# Altium schematic sheet INPUT STAGE.SchDoc: BULLSEYE
size A3; CompanyName: TYMPHANY; DrawnBy: Yetta.He; Organization: PABU; Address1: 11F,block A, CEC building,; Address2: No.2070 Shennan Zhong road,; Address3: Huaqiang North, Futian District,; Address4: Shenzhen,  Guang Dong, P.R.C 518000; DocumentNumber: 2; Revision: 0.0.5; SheetNumber: 2; SheetTotal: 7; Size: A3; Status: DP1
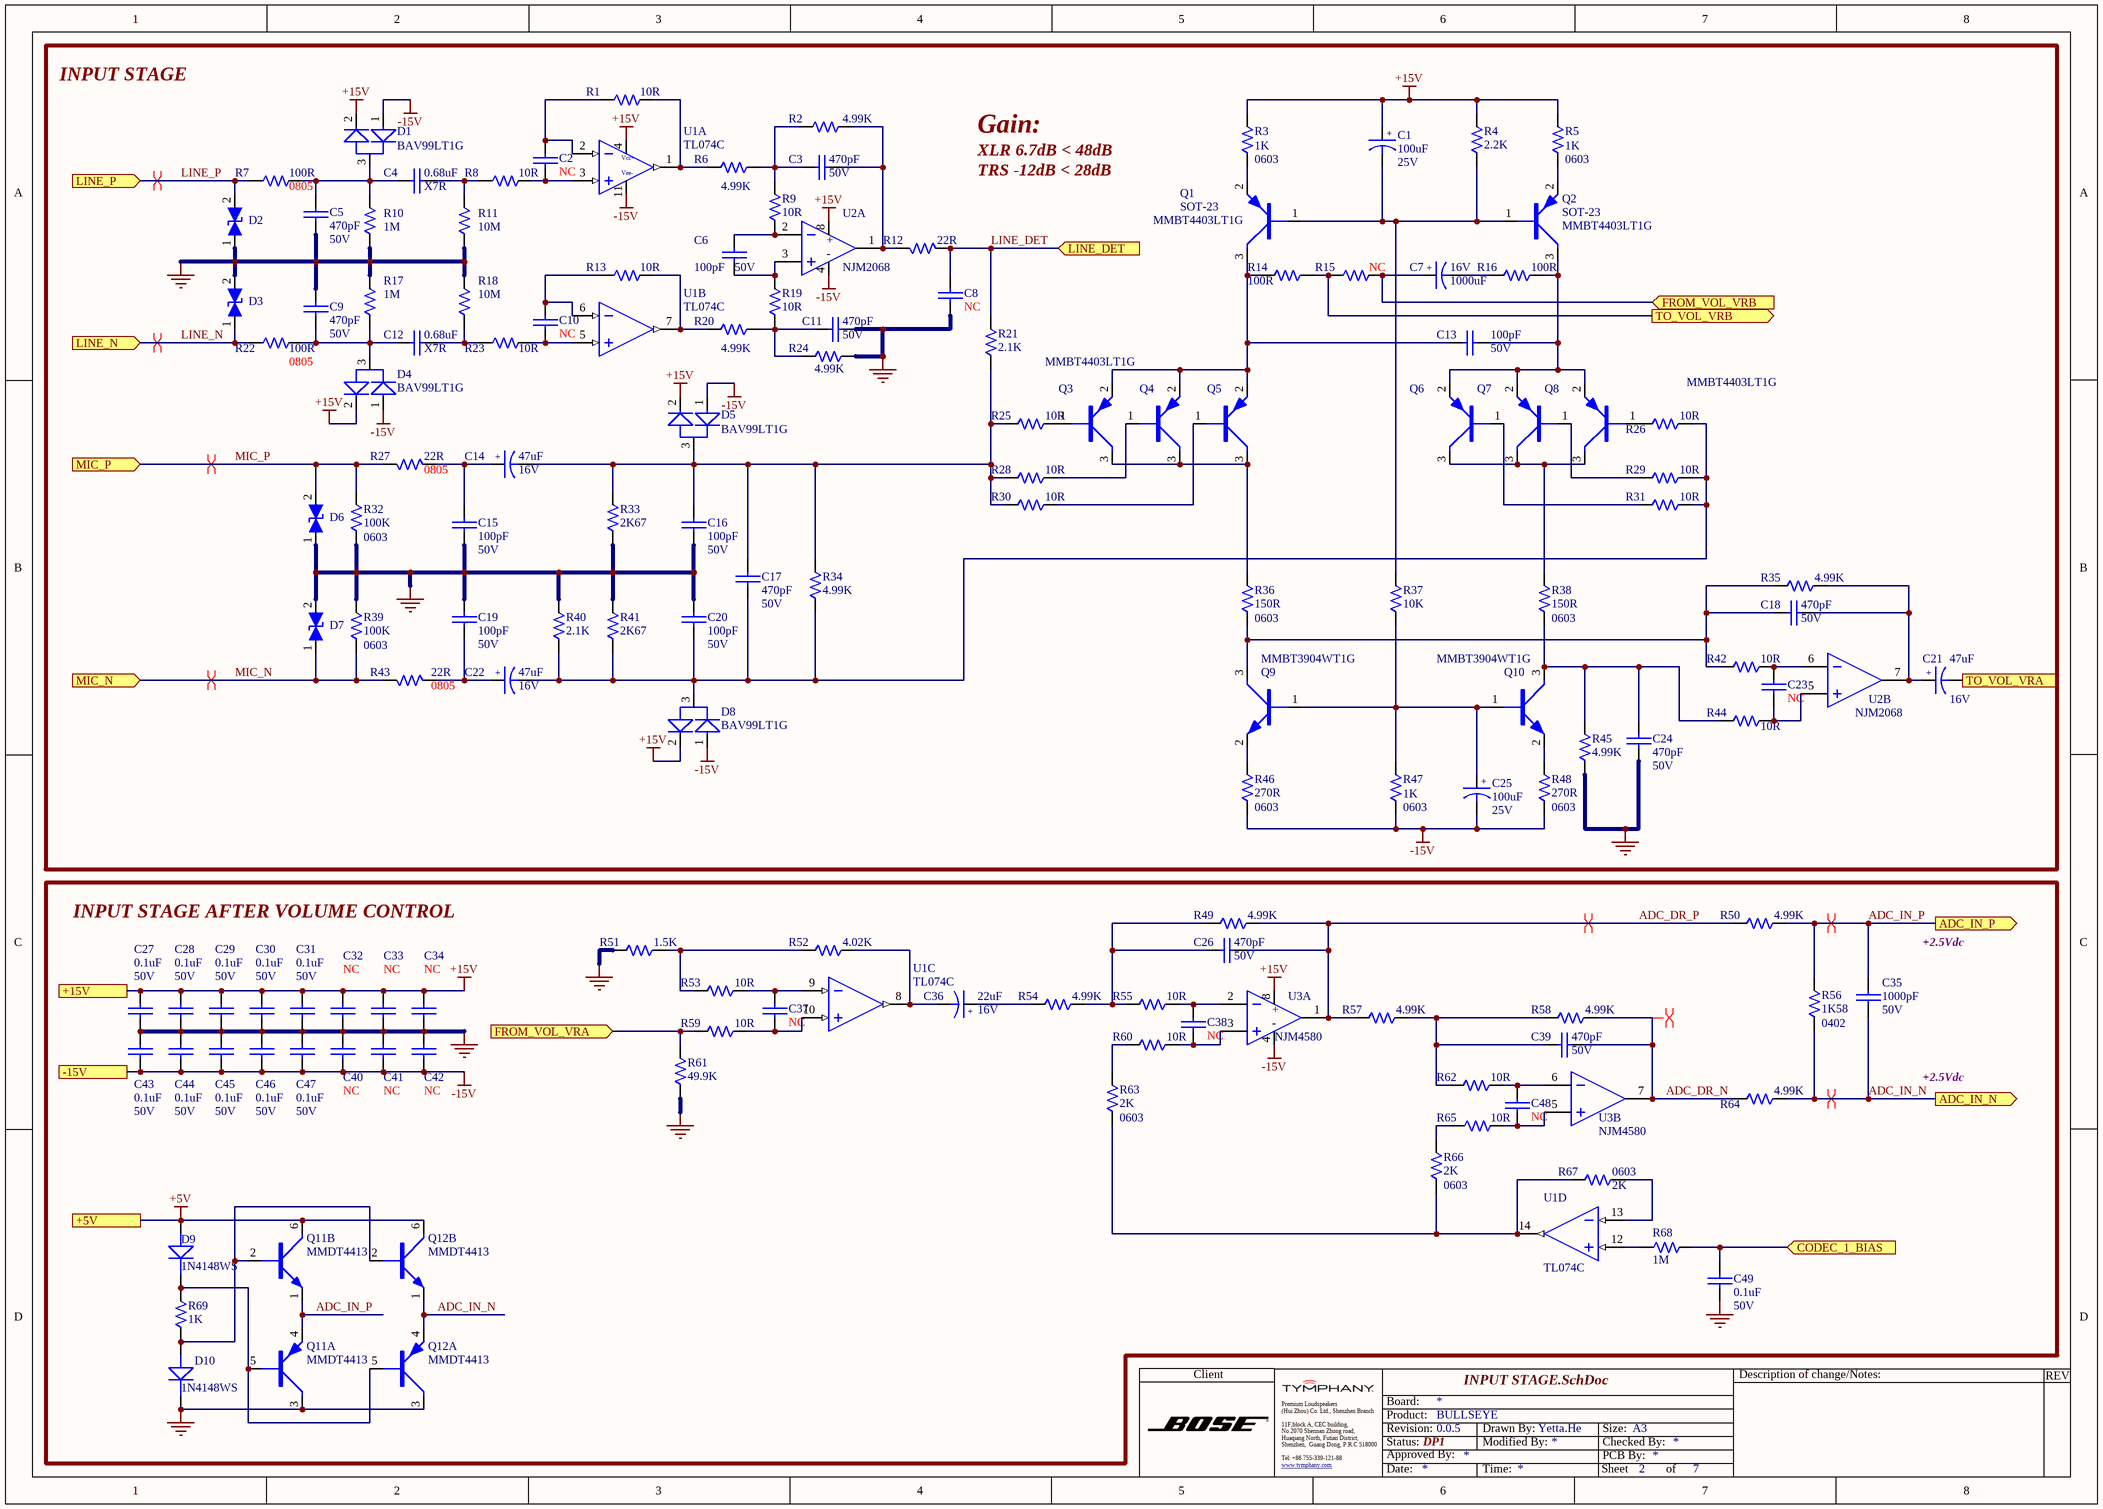
[diagram p0: INPUT STAGE.SchDoc]

## Parts
C1  value 100uF  Voltage: 25V  [CASE - D8]  (hidden comment: T551101445020)
C2  value NC  [CAPC0603-RW]  (hidden comment: CAP0603 NC)
C3  value 470pF  Voltage: 50V  [CAPC0603-RW]  (hidden comment: T541024715508)
C4  value 0.68uF  Other: X7R  [CAPC1206-RW]  (hidden comment: PZL456450-6840)
C5  value 470pF  Voltage: 50V  [CAPC0603-RW]  (hidden comment: T541024715508)
C6  value 100pF  Voltage: 50V  [CAPC0603-RW]  (hidden comment: T541021015508)
C7  value 1000uF  Voltage: 16V  [CAP_Radial_D8L16P3.5]  (hidden comment: T552102435010)
C8  value NC  [CAPC0603-RW]  (hidden comment: CAP0603 NC)
C9  value 470pF  Voltage: 50V  [CAPC0603-RW]  (hidden comment: T541024715508)
C10  value NC  [CAPC0603-RW]  (hidden comment: CAP0603 NC)
C11  value 470pF  Voltage: 50V  [CAPC0603-RW]  (hidden comment: T541024715508)
C12  value 0.68uF  Other: X7R  [CAPC1206-RW]  (hidden comment: PZL456450-6840)
C13  value 100pF  Voltage: 50V  [CAPC0603-RW]  (hidden comment: T541021015508)
C14  value 47uF  Voltage: 16V  [CASE - C5.7]  (hidden comment: T551470435020)
C15  value 100pF  Voltage: 50V  [CAPC0603-RW]  (hidden comment: T541021015508)
C16  value 100pF  Voltage: 50V  [CAPC0603-RW]  (hidden comment: T541021015508)
C17  value 470pF  Voltage: 50V  [CAPC0603-RW]  (hidden comment: T541024715508)
C18  value 470pF  Voltage: 50V  [CAPC0603-RW]  (hidden comment: T541024715508)
C19  value 100pF  Voltage: 50V  [CAPC0603-RW]  (hidden comment: T541021015508)
C20  value 100pF  Voltage: 50V  [CAPC0603-RW]  (hidden comment: T541021015508)
C21  value 47uF  Voltage: 16V  [CASE - C5.7]  (hidden comment: T551470435020)
C22  value 47uF  Voltage: 16V  [CASE - C5.7]  (hidden comment: T551470435020)
C23  value NC  [CAPC0603-RW]  (hidden comment: CAP0603 NC)
C24  value 470pF  Voltage: 50V  [CAPC0603-RW]  (hidden comment: T541024715508)
C25  value 100uF  Voltage: 25V  [CASE - D8]  (hidden comment: T551101445020)
C26  value 470pF  Voltage: 50V  [CAPC0603-RW]  (hidden comment: T541024715508)
C27  value 0.1uF  Voltage: 50V  [CAPC0402-RW]  (hidden comment: PWL456470-1040)
C28  value 0.1uF  Voltage: 50V  [CAPC0402-RW]  (hidden comment: PWL456470-1040)
C29  value 0.1uF  Voltage: 50V  [CAPC0402-RW]  (hidden comment: PWL456470-1040)
C30  value 0.1uF  Voltage: 50V  [CAPC0402-RW]  (hidden comment: PWL456470-1040)
C31  value 0.1uF  Voltage: 50V  [CAPC0402-RW]  (hidden comment: PWL456470-1040)
C32  value NC  [CAPC0603-RW]  (hidden comment: CAP0603 NC)
C33  value NC  [CAPC0603-RW]  (hidden comment: CAP0603 NC)
C34  value NC  [CAPC0603-RW]  (hidden comment: CAP0603 NC)
C35  value 1000pF  Voltage: 50V  [CAPC0603-RW]  (hidden comment: T541021025508)
C36  value 22uF  Voltage: 16V  [CASE - B]  (hidden comment: T551220435010)
C37  value NC  [CAPC0603-RW]  (hidden comment: CAP0603 NC)
C38  value NC  [CAPC0603-RW]  (hidden comment: CAP0603 NC)
C39  value 470pF  Voltage: 50V  [CAPC0603-RW]  (hidden comment: T541024715508)
C40  value NC  [CAPC0603-RW]  (hidden comment: CAP0603 NC)
C41  value NC  [CAPC0603-RW]  (hidden comment: CAP0603 NC)
C42  value NC  [CAPC0603-RW]  (hidden comment: CAP0603 NC)
C43  value 0.1uF  Voltage: 50V  [CAPC0402-RW]  (hidden comment: PWL456470-1040)
C44  value 0.1uF  Voltage: 50V  [CAPC0402-RW]  (hidden comment: PWL456470-1040)
C45  value 0.1uF  Voltage: 50V  [CAPC0402-RW]  (hidden comment: PWL456470-1040)
C46  value 0.1uF  Voltage: 50V  [CAPC0402-RW]  (hidden comment: PWL456470-1040)
C47  value 0.1uF  Voltage: 50V  [CAPC0402-RW]  (hidden comment: PWL456470-1040)
C48  value NC  [CAPC0603-RW]  (hidden comment: CAP0603 NC)
C49  value 0.1uF  Voltage: 50V  [CAPC0402-RW]  (hidden comment: PWL456470-1040)
D1  RCD100099-0010  [SOT23-132-RW]  (value not drawn)
D2  T710500020400  [VAR-0402]  (value not drawn)
D3  T710500020400  [VAR-0402]  (value not drawn)
D4  RCD100099-0010  [SOT23-132-RW]  (value not drawn)
D5  RCD100099-0010  [SOT23-132-RW]  (value not drawn)
D6  T710500020400  [VAR-0402]  (value not drawn)
D7  T710500020400  [VAR-0402]  (value not drawn)
D8  RCD100099-0010  [SOT23-132-RW]  (value not drawn)
D9  RCD114148-0020  [SOD-323]  (value not drawn)
D10  RCD114148-0020  [SOD-323]  (value not drawn)
Q1  Package: SOT-23  [SOT23-132-RW]  (hidden comment: T582003100440)
Q2  Package: SOT-23  [SOT23-132-RW]  (hidden comment: T582003100440)
Q3  T582003100440  [SOT23-132-RW]  (value not drawn)
Q4  T582003100440  [SOT23-132-RW]  (value not drawn)
Q5  T582003100440  [SOT23-132-RW]  (value not drawn)
Q6  T582003100440  [SOT23-132-RW]  (value not drawn)
Q7  T582003100440  [SOT23-132-RW]  (value not drawn)
Q8  T582003100440  [SOT23-132-RW]  (value not drawn)
Q9  T581004222440  [SOT323(SC-70)-R]  (value not drawn)
Q10  T581004222440  [SOT323(SC-70)-R]  (value not drawn)
Q11  RCC004413-0010  [SOT-363]  (value not drawn)  (parts A,B of 2)
Q12  RCC004413-0010  [SOT-363]  (value not drawn)  (parts A,B of 2)
R1  value 10R  [0603-RW]  (hidden comment: QCF011030-1009)
R2  value 4.99K  [0603-RW]  (hidden comment: QCF011030-4991)
R3  value 1K  PACKAGE: 0603  [0603-RW]  (hidden comment: QCF011030-1001)
R4  value 2.2K  [0603-RW]  (hidden comment: QCF011030-2201)
R5  value 1K  PACKAGE: 0603  [0603-RW]  (hidden comment: QCF011030-1001)
R6  value 4.99K  [0603-RW]  (hidden comment: QCF011030-4991)
R7  value 100R  PACKAGE: 0805  [0805-RW]  (hidden comment: QCF081022-1000)
R8  value 10R  [0603-RW]  (hidden comment: QCF011030-1009)
R9  value 10R  [0603-RW]  (hidden comment: QCF011030-1009)
R10  value 1M  [0603-RW]  (hidden comment: QCF011030-1004)
R11  value 10M  [0603-RW]  (hidden comment: QCF011030-1005)
R12  value 22R  [0805-RW]  (hidden comment: QCF081020-2209)
R13  value 10R  [0603-RW]  (hidden comment: QCF011030-1009)
R14  value 100R  [0402-RW]  (hidden comment: QCF161240-1000)
R15  value NC  [0603-RW]  (hidden comment: RES0603 NC)
R16  value 100R  [0402-RW]  (hidden comment: QCF161240-1000)
R17  value 1M  [0603-RW]  (hidden comment: QCF011030-1004)
R18  value 10M  [0603-RW]  (hidden comment: QCF011030-1005)
R19  value 10R  [0603-RW]  (hidden comment: QCF011030-1009)
R20  value 4.99K  [0603-RW]  (hidden comment: QCF011030-4991)
R21  value 2.1K  [0603-RW]  (hidden comment: QCF011030-2101)
R22  value 100R  PACKAGE: 0805  [0805-RW]  (hidden comment: QCF081022-1000)
R23  value 10R  [0603-RW]  (hidden comment: QCF011030-1009)
R24  value 4.99K  [0603-RW]  (hidden comment: QCF011030-4991)
R25  value 10R  [0603-RW]  (hidden comment: QCF011030-1009)
R26  value 10R  [0603-RW]  (hidden comment: QCF011030-1009)
R27  value 22R  PACKAGE: 0805  [0805-RW]  (hidden comment: QCF081020-2209)
R28  value 10R  [0603-RW]  (hidden comment: QCF011030-1009)
R29  value 10R  [0603-RW]  (hidden comment: QCF011030-1009)
R30  value 10R  [0603-RW]  (hidden comment: QCF011030-1009)
R31  value 10R  [0603-RW]  (hidden comment: QCF011030-1009)
R32  value 100K  PACKAGE: 0603  [0603-RW]  (hidden comment: QCF011030-1003)
R33  value 2K67  [0603-RW]  (hidden comment: T502267102399)
R34  value 4.99K  [0603-RW]  (hidden comment: QCF011030-4991)
R35  value 4.99K  [0603-RW]  (hidden comment: QCF011030-4991)
R36  value 150R  PACKAGE: 0603  [0603-RW]  (hidden comment: QCF011030-1500)
R37  value 10K  [0603-RW]  (hidden comment: QCF011030-1002)
R38  value 150R  PACKAGE: 0603  [0603-RW]  (hidden comment: QCF011030-1500)
R39  value 100K  PACKAGE: 0603  [0603-RW]  (hidden comment: QCF011030-1003)
R40  value 2.1K  [0603-RW]  (hidden comment: QCF011030-2101)
R41  value 2K67  [0603-RW]  (hidden comment: T502267102399)
R42  value 10R  [0603-RW]  (hidden comment: QCF011030-1009)
R43  value 22R  PACKAGE: 0805  [0805-RW]  (hidden comment: QCF081020-2209)
R44  value 10R  [0603-RW]  (hidden comment: QCF011030-1009)
R45  value 4.99K  [0603-RW]  (hidden comment: QCF011030-4991)
R46  value 270R  PACKAGE: 0603  [0603-RW]  (hidden comment: QCF011030-2700)
R47  value 1K  PACKAGE: 0603  [0603-RW]  (hidden comment: QCF011030-1001)
R48  value 270R  PACKAGE: 0603  [0603-RW]  (hidden comment: QCF011030-2700)
R49  value 4.99K  [0603-RW]  (hidden comment: QCF011030-4991)
R50  value 4.99K  [0603-RW]  (hidden comment: QCF011030-4991)
R51  value 1.5K  [0603-RW]  (hidden comment: QCF011030-1501)
R52  value 4.02K  [0603-RW]  (hidden comment: T502402102399)
R53  value 10R  [0603-RW]  (hidden comment: QCF011030-1009)
R54  value 4.99K  [0603-RW]  (hidden comment: QCF011030-4991)
R55  value 10R  [0603-RW]  (hidden comment: QCF011030-1009)
R56  value 1K58  Package: 0402  [0402-RW]  (hidden comment: T502158101399)
R57  value 4.99K  [0603-RW]  (hidden comment: QCF011030-4991)
R58  value 4.99K  [0603-RW]  (hidden comment: QCF011030-4991)
R59  value 10R  [0603-RW]  (hidden comment: QCF011030-1009)
R60  value 10R  [0603-RW]  (hidden comment: QCF011030-1009)
R61  value 49.9K  [0603-RW]  (hidden comment: QCF011030-4992)
R62  value 10R  [0603-RW]  (hidden comment: QCF011030-1009)
R63  value 2K  PACKAGE: 0603  [0603-RW]  (hidden comment: QCF011030-2001)
R64  value 4.99K  [0603-RW]  (hidden comment: QCF011030-4991)
R65  value 10R  [0603-RW]  (hidden comment: QCF011030-1009)
R66  value 2K  PACKAGE: 0603  [0603-RW]  (hidden comment: QCF011030-2001)
R67  value 2K  PACKAGE: 0603  [0603-RW]  (hidden comment: QCF011030-2001)
R68  value 1M  [0603-RW]  (hidden comment: QCF011030-1004)
R69  value 1K  [0603-RW]  (hidden comment: QCF011030-1001)
U1  RCI000740-1001  [SO14]  (value not drawn)  (parts A,B,C,D of 4)
U2  RCI002068-0001  [DMP8]  (value not drawn)  (parts A,B of 2)
U3  RCI004580-0001  [DMP8]  (value not drawn)  (parts A,B of 2)

## Blocks framed on the sheet
Gain:: C1-C25 D1-D8 Q1-Q10 R1-R48 U1 U2
INPUT STAGE AFTER VOLUME CONTROL: C26-C49 D9 D10 Q11 Q12 R49-R69 U1 U3

## Ports
+5V, +15V, -15V, ADC_IN_N (out), ADC_IN_P (out), CODEC_1_BIAS (in), FROM_VOL_VRA (in), FROM_VOL_VRB (in), LINE_DET (in), LINE_N (in), LINE_P (in), MIC_N (in), MIC_P (in), TO_VOL_VRA (out), TO_VOL_VRB (out)

## Nets
+5V: D9.1(A) Q11.6(D) Q12.6(D) ; port +5V
+15V: C1.1 C27.1 C28.1 C29.1 C30.1 C31.1 C32.1 C33.1 C34.1 D1.2(K) D4.2(K) D5.2(K) D8.2(K) R3.2 R4.2 R5.2 U1.4(+V) U2.8 U3.8 ; port +15V
-15V: C25.2 C40.1 C41.1 C42.1 C43.2 C44.2 C45.2 C46.2 C47.2 D1.1(A) D4.1(A) D5.1(A) D8.1(A) R46.1 R47.1 R48.1 U1.11(-V) U2.4 U3.4 ; port -15V
GND: C5.2 C8.1 C9.1 C11.2 C15.2 C16.2 C19.1 C20.2 C24.1 C27.2 C28.2 C29.2 C30.2 C31.2 C32.2 C33.2 C34.2 C40.2 C41.2 C42.2 C43.1 C44.1 C45.1 C46.1 C47.1 C49.2 D2.1 D3.2 D6.1 D7.2 D10.2(K) Q11.3(D) Q12.3(D) R10.1 R11.1 R17.2 R18.2 R24.1 R32.1 R33.1 R39.2 R40.2 R41.2 R45.1 R51.2 R61.1
ADC_DR_N: C39.2 R58.1 R64.2 U3.7(OUT)
ADC_DR_P: C26.2 R49.1 R50.2 R57.2 U3.1(OUT)
ADC_IN_N: C35.2 Q12.1(S) Q12.4(S) R56.1 R64.1 ; port ADC_IN_N
ADC_IN_P: C35.1 Q11.1(S) Q11.4(S) R50.1 R56.2 ; port ADC_IN_P
CODEC_1_BIAS: C49.1 R68.2 ; port CODEC_1_BIAS
FROM_VOL_VRA: R59.2 R61.2 ; port FROM_VOL_VRA
FROM_VOL_VRB: C7.1 R15.2 ; port FROM_VOL_VRB
LINE_DET: C8.2 R12.1 R21.2 ; port LINE_DET
LINE_N: D3.1 R22.1 ; port LINE_N
LINE_P: D2.2 R7.1 ; port LINE_P
MIC_N: D7.1 R39.1 R43.2 ; port MIC_N
MIC_P: D6.2 R27.2 R32.2 ; port MIC_P
TO_VOL_VRA: C21.2 ; port TO_VOL_VRA
TO_VOL_VRB: R14.1 R15.1 ; port TO_VOL_VRB
NetC1_2: C1.2 Q1.1(B) Q2.1(B) R4.1 R37.2
NetC2_1: C2.1 R1.1 U1.2(IN-)
NetC2_2: C2.2 R8.2 U1.3(IN+)
NetC3_1: C3.1 R2.2 R6.1 R9.2
NetC3_2: C3.2 R2.1 R12.2 U2.1(OUT)
NetC4_1: C4.1 C5.1 D1.3 R7.2 R10.2
NetC4_2: C4.2 R8.1 R11.2
NetC6_1: C6.1 R9.1 U2.2(IN-)
NetC6_2: C6.2 R19.2 U2.3(IN+)
NetC7_2: C7.2 R16.2
NetC9_2: C9.2 C12.1 D4.3 R17.1 R22.2
NetC10_1: C10.1 R13.1 U1.6(IN-)
NetC10_2: C10.2 R23.2 U1.5(IN+)
NetC11_1: C11.1 R19.1 R20.1 R24.2
NetC12_2: C12.2 R18.1 R23.1
NetC13_1: C13.1 Q2.3(C) Q6.2(E) Q7.2(E) Q8.2(E) R16.1
NetC13_2: C13.2 Q1.3(C) Q3.2(E) Q4.2(E) Q5.2(E) R14.2
NetC14_1: C14.1 C15.1 R27.1
NetC14_2: C14.2 C16.1 C17.1 D5.3 R21.1 R25.2 R28.2 R30.2 R33.2 R34.2
NetC17_2: C17.2 C20.1 C22.2 D8.3 R26.1 R29.1 R31.1 R34.1 R40.1 R41.1
NetC18_1: C18.1 C21.1 R35.1 U2.7(OUT)
NetC18_2: C18.2 Q9.3(C) R35.2 R36.1 R42.2
NetC19_2: C19.2 C22.1 R43.1
NetC23_1: C23.1 R42.1 U2.6(IN-)
NetC23_2: C23.2 R44.1 U2.5(IN+)
NetC24_2: C24.2 Q10.3(C) R38.1 R44.2 R45.2
NetC25_1: C25.1 Q9.1(B) Q10.1(B) R37.1 R47.2
NetC26_1: C26.1 R49.2 R54.1 R55.2
NetC36_1: C36.1 R54.2
NetC36_2: C36.2 R52.1 U1.8(OUT)
NetC37_1: C37.1 R59.1 U1.10(IN+)
NetC37_2: C37.2 R53.1 U1.9(IN-)
NetC38_1: C38.1 R60.1 U3.3(IN+)
NetC38_2: C38.2 R55.1 U3.2(IN-)
NetC39_1: C39.1 R57.1 R58.2 R62.2
NetC48_1: C48.1 R65.2 U3.5(IN+)
NetC48_2: C48.2 R62.1 U3.6(IN-)
NetD9_2: D9.2(K) Q11.5(G) Q12.5(G) R69.2
NetD10_1: D10.1(A) Q11.2(G) Q12.2(G) R69.1
NetQ1_2: Q1.2(E) R3.1
NetQ2_2: Q2.2(E) R5.1
NetQ3_1: Q3.1(B) R25.1
NetQ3_3: Q3.3(C) Q4.3(C) Q5.3(C) R36.2
NetQ4_1: Q4.1(B) R28.1
NetQ5_1: Q5.1(B) R30.1
NetQ6_1: Q6.1(B) R31.2
NetQ6_3: Q6.3(C) Q7.3(C) Q8.3(C) R38.2
NetQ7_1: Q7.1(B) R29.2
NetQ8_1: Q8.1(B) R26.2
NetQ9_2: Q9.2(E) R46.2
NetQ10_2: Q10.2(E) R48.2
NetR1_2: R1.2 R6.2 U1.1(OUT)
NetR13_2: R13.2 R20.2 U1.7(OUT)
NetR51_1: R51.1 R52.2 R53.2
NetR60_2: R60.2 R63.2
NetR63_1: R63.1 R66.1 R67.2 U1.14(OUT)
NetR65_1: R65.1 R66.2
NetR67_1: R67.1 U1.13(IN-)
NetR68_1: R68.1 U1.12(IN+)

## Layout directives
differential pair: ADC_DR_N, ADC_DR_P, ADC_IN_N, ADC_IN_P, LINE_N, LINE_P, MIC_N, MIC_P

## Notes on the sheet
- INPUT STAGE
- TRS -12dB < 28dB
- XLR 6.7dB < 48dB
- +2.5Vdc
- Client
- Description of change/Notes:
- REV
- Premium Loudspeakers
- (Hui Zhou) Co. Ltd., Shenzhen Branch
- Tel: +86 755-339-121-88
- Board:
- Status:
- Revision:
- Product:
- Approved By:
- Drawn By:
- Modified By:
- Checked By:
- PCB By:
- Size:
- www.tymphany.com <http://www.tymphany.com>
- Date:
- Time:
- Sheet
- of
- (in symbol CAP E 22uF 16V 20% SMD_VEJ220M1CTR-0405) +
- (in symbol CAP E 47uF 16V 20% SMD_VEJ470M1CTR-0506) +
- (in symbol CAP E 100uF 25V 20% SMD_VEJ101M1ETR-0607) +
- (in symbol CAP E Aluminum 1000uF 16V 20%_RXW102M1CBKF0815) +
- (in symbol NJM2068, part A) +; -
- (in symbol NJM4580, part A) +; -
- (in symbol TL074C, part A) Vcc+; Vee-

## Library data of the parts
C1 C25 = CAP E 100uF 25V 20% SMD_VEJ101M1ETR-0607: E 100UF 25V +-20% 6.3X7. VEJ101M1E K; MFG: LELON; Tolerance: 20%; Type: Capacitor; CREATE_NAME: Nathan; DIP&SMD: SMD; SAP: T551101445020; PACKAGE: CASE - C7.7; Vendor Name: *; Vendor Code: *; MFG Part: VEJ101M1ETR-0607; Other: *; CREATE_TIME: 01-Mar-2019; Customer Specific: N/A
C2 C8 C10 C23 C32-C34 C37 C38 C40-C42 C48 = CAP0603 NC: NC; Type: Capacitor; CREATE_NAME: Tom; DIP&SMD: SMD; SAP: *; PACKAGE: CAPC0603; Vendor Code: *; Vendor Name: *; MFG: *; MFG Part: *; Other: *; Tolerance: *; CREATE_TIME: 18-Mar-2016; Voltage: *; Customer Specific: N/A
C3 C11 C18 C24 C26 C39 = CAP0603 470pF 50V 2%_NPO_WALSIN: CAP NPO 470PF 50V +-2% 0603 WALSIN L; Tolerance: 2%; Type: Capacitor; DIP&SMD: SMD; CREATE_NAME: Nathan; SAP: T541024715508; PACKAGE: CAPC0603; Vendor Name: *; MFG: WALSIN; MFG Part: *; Other: NPO; Customer Specific: N/A; CREATE_TIME: 13-July-2016
C4 C12 = CAP1206 0.68uF 25V 10%: CHIP CAP 0.68uF 25V 10% 1206 X7R; SAP: T542046847408; Vendor Code: 10010262; Vendor Name: ¶«Ý¸ÊÐÇçÔ¶µç×ÓÓÐÏÞ¹«Ë¾; Type: Capacitor; PACKAGE: CAPC1206; MFG: *; MFG Part: *; Tolerance: 10%
C5 C9 C17 = CAP0603 470pF 50V 2%_NPO_WALSIN: CAP NPO 470PF 50V +-2% 0603 WALSIN L; Tolerance: 2%; Type: Capacitor; CREATE_NAME: Nathan; DIP&SMD: SMD; SAP: T541024715508; PACKAGE: CAPC0603; Vendor Name: *; MFG: WALSIN; MFG Part: *; Other: NPO; CREATE_TIME: 13-July-2016; Customer Specific: N/A
C6 C13 C15 C16 C19 C20 = CAP0603 100pF 50V 2%_NPO_WALSIN: CAP NPO 100PF 50V +-2% 0603 WALSIN L; Tolerance: 2%; Type: Capacitor; CREATE_NAME: Nathan; DIP&SMD: SMD; SAP: T541021015508; PACKAGE: CAPC0603; Vendor Name: *; MFG: WALSIN; MFG Part: *; Other: NPO; CREATE_TIME: 13-July-2016; Customer Specific: N/A
C7 = CAP E Aluminum 1000uF 16V 20%_RXW102M1CBKF0815: E 1000U 16V +-20% 8X15MM RXW102M1C K; MFG: LELON; Other: -55+105; Tolerance: 20%; Type: Capacitor; CREATE_NAME: Nathan; DIP&SMD: DIP; SAP: T552102435010; PACKAGE: 1000uF/16V; Vendor Name: *; Vendor Code: *; MFG Part: RXW102M1CBKF0815; CREATE_TIME: 24-Apr-2019; Customer Specific: N/A
C14 C21 C22 = CAP E 47uF 16V 20% SMD_VEJ470M1CTR-0506: E 47UF 16V +-20% 5X6 VEJ470M1C K; MFG: LELON; Tolerance: 20%; Type: Capacitor; CREATE_NAME: Nathan; DIP&SMD: SMD; SAP: T551470435020; Vendor Name: *; Vendor Code: *; MFG Part: VEJ470M1CTR-0506; CREATE_TIME: 15-Mar-2019; PACKAGE: CASE - C5.7; Other: *; Customer Specific: N/A
C27-C31 C43-C47 C49 = CAP0402 0.1uF 50V 10%: CAP, CER, 0.1uF, 10%, 50V, X7R, 0402, RoHS; SAP: T542011047508; Type: Capacitor; CREATE_NAME: TOM@Deftronics; PACKAGE: CAPC0402; Vendor Name: *; MFG: *; MFG Part: *; Other: X7R; Tolerance: 10%; CREATE_TIME: 13-May-2014
C35 = CAP0603 1000pF 50V 2%_NPO_WALSIN: CAP NPO 1000P 50V +-2% 0603 WALSIN L; Tolerance: 2%; Type: Capacitor; CREATE_NAME: Nathan; DIP&SMD: SMD; SAP: T541021025508; PACKAGE: CAPC0603; Vendor Name: *; MFG: WALSIN; MFG Part: *; Other: NPO; CREATE_TIME: 13-July-2016; Customer Specific: N/A
C36 = CAP E 22uF 16V 20% SMD_VEJ220M1CTR-0405: E 22UF 16V +-20% 4.3X4. VEJ220M1C K; MFG: LELON; Type: Capacitor; CREATE_NAME: Nathan; DIP&SMD: SMD; SAP: T551220435010; PACKAGE: CASE - B; MFG Part: VEJ220M1CTR-0405; Other: *; CREATE_TIME: 01-Mar-2019; Customer Specific: N/A
D1 D4 D5 D8 = BAV99LT1G: SWITC 70V 215MA BAV99LT1G ON SE G; SAP: T572003550122; MFG: ON SEMI; Voltage: 100V; Power: 225MW; Type: DIODE; DIP&SMD: SMD; Vendor Code: *; Vendor Name: *; Current: 215mA; Customer Specific: N/A; Package: SOT-23; MFG Part: BAV99LT1G
D2 D3 D6 D7 = AVRM1005C120MTAAB: VR AVRM1005C120MTAAB TDK K; Type: Zener DIODE; CREAT NAME: QCD; DIP&SMD: SMD; SAP: T710500020400; MFG: TDK; Vendor Code: *; Vendor Name: *; CREAT TIME: 02-Sep-2016; MFG Part: AVRM1005C120MTAAB
D9 D10 = 1N4148WS: DIODE SW 1N4148 VF=0.7V SOD-323; MFG: TW SEMICONDUCTOR; SAP: T572005070208; Voltage: 100V; Current: 150MA; Vendor Name: *; Vendor Code: *; Type: DIODE; Package: SOD-323; MFG Part: 1N4148WS
Q1-Q8 = MMBT4403LT1G: PNP -40V MMBT4403LT1G SOT23 ON K; Voltage: 40V; Current: 600mA; DIP&SMD: SMD; CREATE NAME: Nathan; SAP: T582003100440; MFG: ON; Vendor Code: *; Vendor Name: *; Type: PNP; MFG Part: MMBT4403LT1G; Customer Specific: N/A; CREATE TIME: 25-Dec-2018
  Q3-Q8: Package: SOT-23
Q9 Q10 = MMBT3904WT1G: NPN 40V MMBT3904WT1G SC70 ( ON K; CREATE_NAME: Nathan; DIP&SMD: SMD; SAP: T581004222440; MFG: ON; Vendor Code: *; Vendor Name: *; Voltage: *; Type: NPN; CREATE_TIME: 11-Mar-2019; Current: *; MFG Part: MMBT3904WT1G; Customer Specific: N/A
Q11 Q12 = MMDT4413: COMPOSOTE TRANSISTOR SOT-363 MMDT4413; MFG: DIODES; SAP: T580000432738; CREATE_NAME: Nathan; Vendor Name: *; Vendor Code: *; Voltage: *; Current: *; Type: TRANSISTOR; CREATE_TIME: 20-OCT-2014; MFG_Part: MMDT4413
R1 R8 R9 R13 R19 R23 R25 R26 R28-R31 R42 R44 R53 R55 R59 R60 R62 R65 = RES0603 1/10W 1% 10 OHM: CHIP 10 OHM 100PPM +-1% 0603 WALS L; Vendor Code: 10010262; SAP: T502100A02399; Power: 1/10W; Vendor Name: 东莞市晴远电子有限公司; MFG: WALSIN (華新); TOL: 1%; DIP&SMD: SMD; MFG Part: *; Type: Resistor; PACKAGE: 0603; Customer Specific: N/A
R2 R6 R20 R24 R34 R35 R45 R49 R50 R54 R57 R58 R64 = RES0603 1/10W 1% 4.99K OHM: GP CHIP RES. 4.99K OHM 1/10W 1% 0603; Vendor Code: 10010262; SAP: T502499102399; Vendor Name: 东莞市晴远电子有限公司; DIP&SMD: SMD; Power: 1/10W; MFG Part: *; MFG: *; TOL: 1%; Type: Resistor; PACKAGE: 0603; Customer Specific: N/A
R3 R5 R47 R69 = RES0603 1/10W 1% 1K OHM: GP CHIP RES. 1K OHM 1/10W 1% 0603; Vendor Code: 10010262; SAP: T502100102399; Vendor Name: 东莞市晴远电子有限公司; DIP&SMD: SMD; Power: 1/10W; MFG: *; MFG Part: *; TOL: 1%; Type: Resistor; Customer Specific: N/A
  R69: PACKAGE: 0603
R4 = RES0603 1/10W 1% 2.2K OHM: GP CHIP RES. 2.2K OHM 1/10W 1% 0603; Vendor Code: 10010262; SAP: T502220102399; Vendor Name: 东莞市晴远电子有限公司; DIP&SMD: SMD; Power: 1/10W; MFG Part: *; MFG: *; TOL: 1%; Type: Resistor; PACKAGE: 0603; Customer Specific: N/A
R7 R22 = RES0805 1/8W 1% 100 OHM: GP CHIP RES. 100 OHM 1/8W 1% 0805; Vendor Code: 10010262; SAP: T502100003399; Vendor Name: 东莞市晴远电子有限公司; MFG: WALSIN (華新); DIP&SMD: SMD; Power: 1/8W; MFG Part: *; TOL: 1%; Type: Resistor; Customer Specific: N/A
R10 R17 R68 = RES0603 1/10W 1% 1M OHM: GP CHIP RES. 1M OHM 1/10W 1% 0603; Vendor Code: 10010262; SAP: T502100402399; Vendor Name: ¶«Ý¸ÊÐÇçÔ¶µç×ÓÓÐÏÞ¹«Ë¾; Power: *; MFG: *; MFG Part: *; TOL: 1%; Type: Resistor; PACKAGE: 0603
R11 R18 = RES0603 1/10W 1% 10M OHM: CHIP RES. 10M OHM 1/10W 1% 0603; Vendor Code: 10010262; SAP: T502100502399; Vendor Name: ¶«Ý¸ÊÐÇçÔ¶µç×ÓÓÐÏÞ¹«Ë¾; Power: *; MFG Part: *; MFG: *; TOL: 1%; Type: Resistor; PACKAGE: 0603
R12 R27 R43 = RES0805 1/8W 1% 22 OHM: CHIP RES 22 OHM 1/8W 1% 0805; Vendor Code: 10010262; SAP: T502220A03399; Vendor Name: 东莞市晴远电子有限公司; DIP&SMD: SMD; Power: 1/8W; MFG Part: *; MFG: *; TOL: 1%; Type: Resistor; Customer Specific: N/A
  R12: PACKAGE: 0805
R14 R16 = RES0402 1/16W 1% 100 OHM: CHIP RES 100 OHM 1/16W 1% 0402; SAP: T502100001399; MFG: WALSIN; Vendor Code: *; Power: *; Vendor Name: *; MFG Part: *; TOL: 1%; Type: Resistor; PACKAGE: 0402
R15 = RES0603 NC: NC; CREATE_NAME: Tom; DIP&SMD: SMD; SAP: *; Tolerance: *; MFG Part: *; MFG: *; Vendor Code: *; Vendor Name: *; Type: Resistor; Power: *; CREATE_TIME: 18-Mar-2016; Customer Specific: N/A; Package: 0603
R21 R40 = RES0603 1/10W 1% 2.1K OHM: CHIP RES 2.1K OHM 1/10W  1% 0603; Vendor Code: 10010262; SAP: T502210102399; Vendor Name: 东莞市晴远电子有限公司; DIP&SMD: SMD; Power: 1/10W; MFG Part: *; MFG: *; TOL: 1%; Type: Resistor; PACKAGE: 0603; Customer Specific: N/A
R32 R39 = RES0603 1/10W 1% 100K OHM: GP CHIP RES. 100K OHM 1/10W 1% 0603; Vendor Code: 10010262; SAP: T502100302399; Vendor Name: 东莞市晴远电子有限公司; DIP&SMD: SMD; Power: 1/10W; MFG Part: *; MFG: *; TOL: 1%; Type: Resistor; Customer Specific: N/A
R33 R41 = RES0603 1/10W 1% 2.67K OHM_WALSIN: CHIP 2.67K OHM 100PPM +-1% 0603 WALS L; Power: 1/10W; MFG: WALSIN (華新); TOL: 1%; CREATE_NAME: Nathan; DIP&SMD: SMD; Vendor Code: *; SAP: T502267102399; Vendor Name: *; MFG Part: *; Type: Resistor; PACKAGE: 0603; CREATE_TIME: 03-July-2016; Customer Specific: N/A
R36 R38 = RES0603 1/10W 1% 150 OHM: GP CHIP RES. 150 OHM 1/10W 1% 0603; Vendor Code: 10010262; SAP: T502150002399; Vendor Name: 东莞市晴远电子有限公司; DIP&SMD: SMD; Power: 1/10W; MFG Part: *; MFG: *; TOL: 1%; Type: Resistor; Customer Specific: N/A
R37 = RES0603 1/10W 1% 10K OHM: GP CHIP RES. 10K OHM 1/10W 1% 0603; Vendor Code: 10010262; SAP: T502100202399; Vendor Name: ¶«Ý¸ÊÐÇçÔ¶µç×ÓÓÐÏÞ¹«Ë¾; Power: *; MFG Part: *; MFG: *; TOL: 1%; Type: Resistor; PACKAGE: 0603
R46 R48 = RES0603 1/10W 1% 270 OHM: CHIP RES 270 OHM 1/10W 1% 0603; Vendor Code: 10010262; SAP: T502270002399; Vendor Name: 东莞市晴远电子有限公司; DIP&SMD: SMD; Power: 1/10W; MFG Part: *; MFG: *; TOL: 1%; Type: Resistor; Customer Specific: N/A
R51 = RES0603 1/10W 1% 1.5K OHM: GP CHIP RES. 1.5K OHM 1/10W 1% 0603; Vendor Code: 10010262; SAP: T502150102399; Vendor Name: 东莞市晴远电子有限公司; DIP&SMD: SMD; Power: 1/10W; MFG Part: *; MFG: *; TOL: 1%; Type: Resistor; PACKAGE: 0603; Customer Specific: N/A
R52 = RES0603 1/10W 1% 4.02KOHM: CHIP 4.02K OHM 100PPM +-1% 0603 WALS L; Power: 1/10W; TOL: 1%; CREATE_NAME: Tom; DIP&SMD: SMD; Vendor Code: *; SAP: T502402102399; Vendor Name: *; MFG: *; MFG Part: *; Type: Resistor; CREATE_TIME: 14-Sep-2015; PACKAGE: 0603; Customer Specific: N/A
R56 = RES0402 1/16W 1% 1.58K OMH_WALSIN: CHIP 1.58K OHM 100PPM +-1% 0402 WALS L; Power: 1/16W; MFG: WALSIN (華新); TOL: 1%; CREATE_NAME: Nathan; DIP&SMD: SMD; Vendor Code: *; SAP: T502158101399; Vendor Name: *; MFG Part: *; Type: Resistor; CREATE_TIME: 25-May-2016; Customer Specific: N/A
R61 = RES0603 1/10W 1% 49.9K OHM: GP CHIP RES. 49.9K OHM 1/10W 1% 0603; Vendor Code: 10010262; SAP: T502499202399; Vendor Name: 东莞市晴远电子有限公司; DIP&SMD: SMD; Power: 1/10W; MFG Part: *; MFG: *; TOL: 1%; Type: Resistor; PACKAGE: 0603; Customer Specific: N/A
R63 R66 R67 = RES0603 1/10W 1% 2K OHM: GP CHIP RES. 2K OHM 1/10W 1% 0603; Vendor Code: 10010262; SAP: T502200102399; Vendor Name: 东莞市晴远电子有限公司; DIP&SMD: SMD; Power: 1/10W; MFG Part: *; MFG: *; TOL: 1%; Type: Resistor; Customer Specific: N/A
U1 = TL074C: GP IC 14P TL074CDT PLASTIC MICRO PACKAG; SAP: T610500023802; MFG: ST; Vendor Code: 10009129; Vendor Name: WING HING ENTERPRISE CO; DIP&SMD: SMD; Type: IC; Customer Specific: N/A; MFG Part: TL074C
U2 = NJM2068: IC OP AMP NJM2068 DUAL SO-8; MFG: JRC; SAP: T610500024606; CREATE_NAME: GordonL@Deftronics; Vendor Code: *; Vendor Name: *; Type: IC; CREATE_TIME: 31-MAY-2013; MFG Part: NJM2068
U3 = NJM4580: IC OP AMP NJM4580  DUAL SO-8; MFG: JRC; SAP: T610500010706; CREATE_NAME: GordonL@Deftronics; Vendor Code: *; Vendor Name: *; Type: IC; CREATE_TIME: 31-MAY-2013; MFG Part: NJM4580